# EAGLE schematic cnc-data-panel (EAGLE 7.3.0)
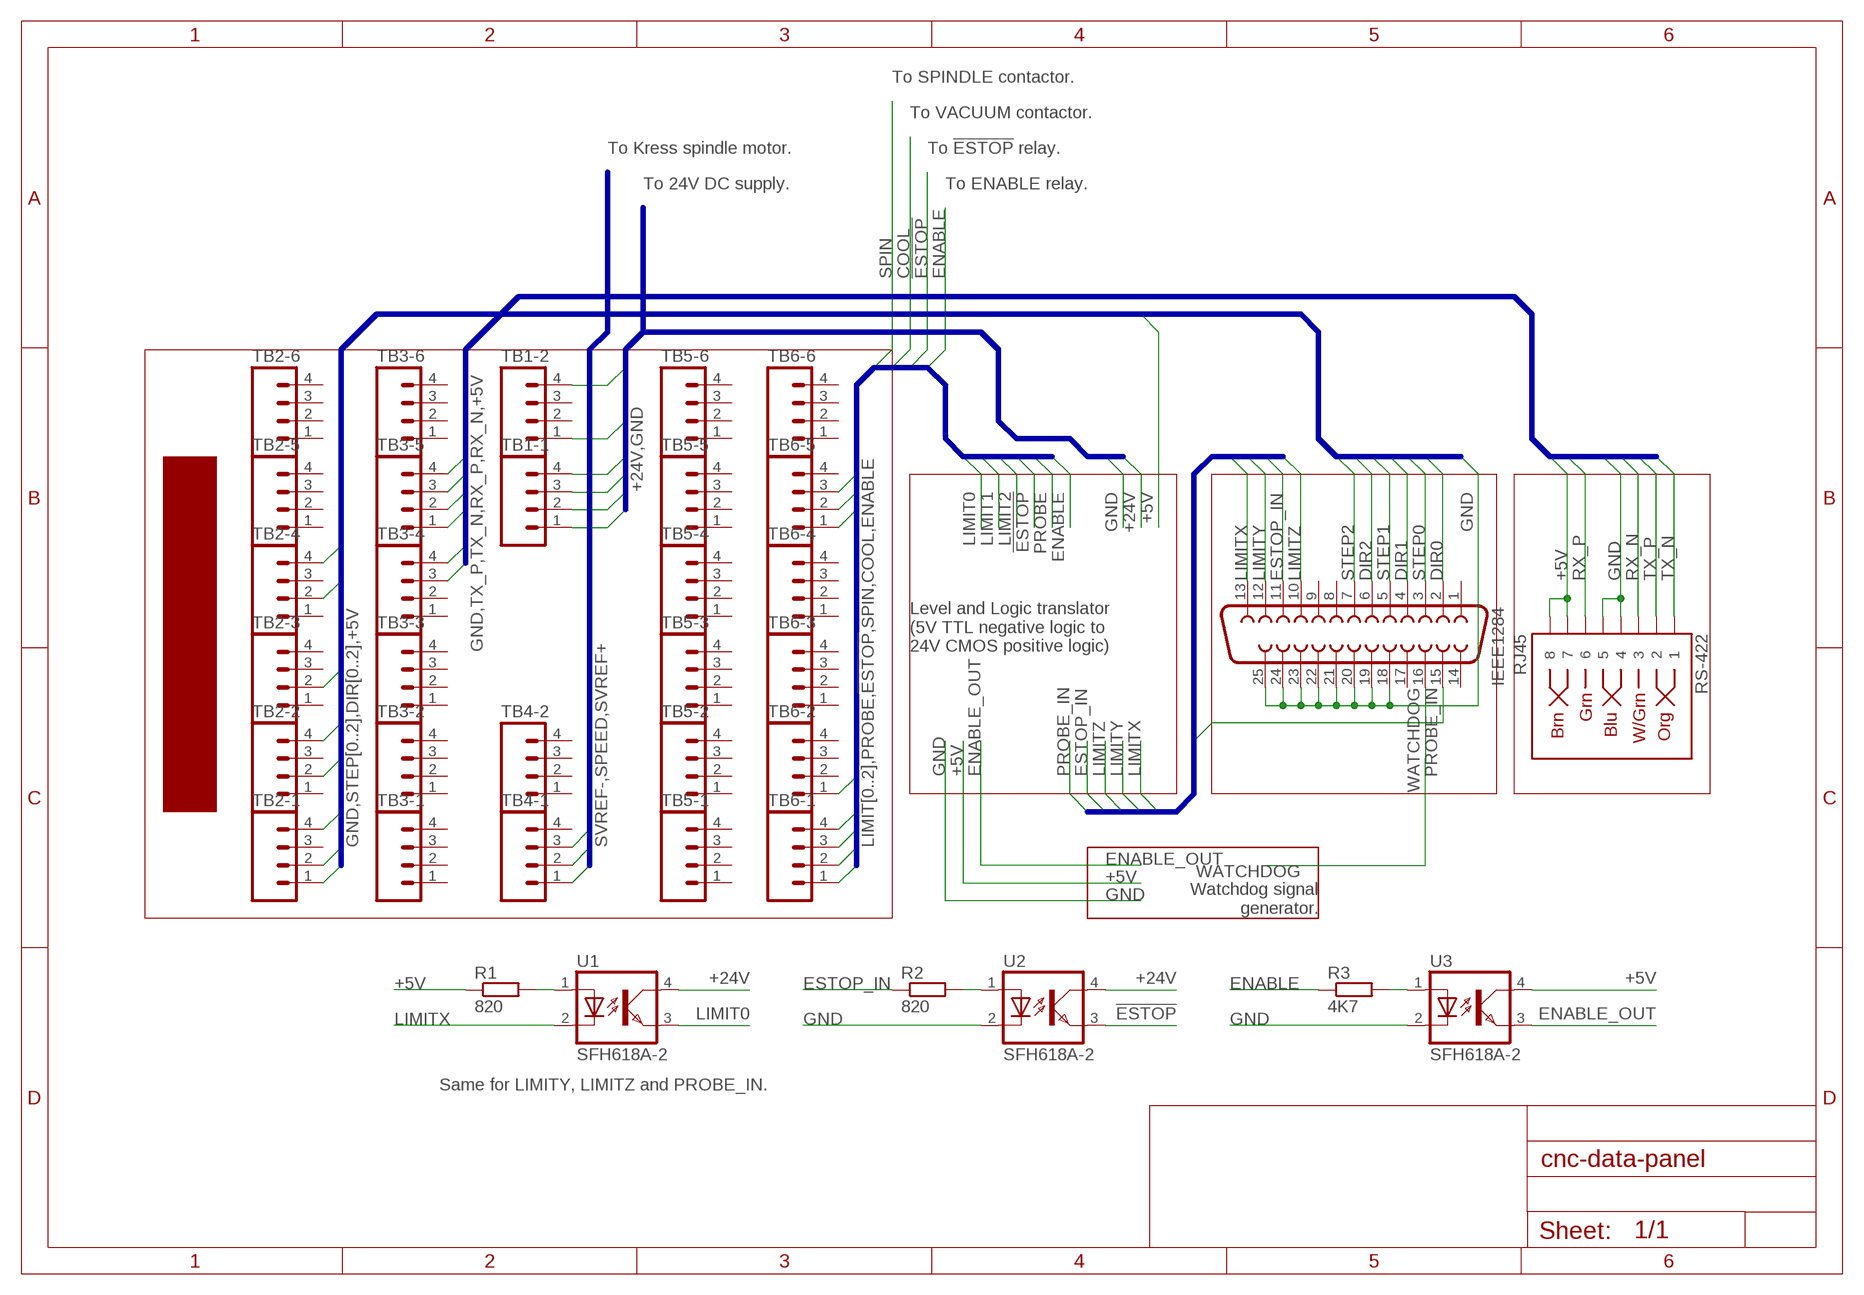
[diagram p0: schematic, sheet 1]

## Parts
IEEE1284  F25VP  [F25VP]
R1  820  R-EU_0204/2V  [0204V]
R2  820  R-EU_0204/2V  [0204V]
R3  4K7  R-EU_0204/2V  [0204V]
RS-422  RJ45  RJ45-8PTH  [RJ45-8]
TB1-1  M04SCREW  [SCREWTERMINAL-3.5MM-4]
TB1-2  M04SCREW  [SCREWTERMINAL-3.5MM-4]
TB2-1  M04SCREW  [SCREWTERMINAL-3.5MM-4]
TB2-2  M04SCREW  [SCREWTERMINAL-3.5MM-4]
TB2-3  M04SCREW  [SCREWTERMINAL-3.5MM-4]
TB2-4  M04SCREW  [SCREWTERMINAL-3.5MM-4]
TB2-5  M04SCREW  [SCREWTERMINAL-3.5MM-4]
TB2-6  M04SCREW  [SCREWTERMINAL-3.5MM-4]
TB3-1  M04SCREW  [SCREWTERMINAL-3.5MM-4]
TB3-2  M04SCREW  [SCREWTERMINAL-3.5MM-4]
TB3-3  M04SCREW  [SCREWTERMINAL-3.5MM-4]
TB3-4  M04SCREW  [SCREWTERMINAL-3.5MM-4]
TB3-5  M04SCREW  [SCREWTERMINAL-3.5MM-4]
TB3-6  M04SCREW  [SCREWTERMINAL-3.5MM-4]
TB4-1  M04SCREW  [SCREWTERMINAL-3.5MM-4]
TB4-2  M04SCREW  [SCREWTERMINAL-3.5MM-4]
TB5-1  M04SCREW  [SCREWTERMINAL-3.5MM-4]
TB5-2  M04SCREW  [SCREWTERMINAL-3.5MM-4]
TB5-3  M04SCREW  [SCREWTERMINAL-3.5MM-4]
TB5-4  M04SCREW  [SCREWTERMINAL-3.5MM-4]
TB5-5  M04SCREW  [SCREWTERMINAL-3.5MM-4]
TB5-6  M04SCREW  [SCREWTERMINAL-3.5MM-4]
TB6-1  M04SCREW  [SCREWTERMINAL-3.5MM-4]
TB6-2  M04SCREW  [SCREWTERMINAL-3.5MM-4]
TB6-3  M04SCREW  [SCREWTERMINAL-3.5MM-4]
TB6-4  M04SCREW  [SCREWTERMINAL-3.5MM-4]
TB6-5  M04SCREW  [SCREWTERMINAL-3.5MM-4]
TB6-6  M04SCREW  [SCREWTERMINAL-3.5MM-4]
U1  SFH618A-2  [DIP4]
U2  SFH618A-2  [DIP4]
U3  SFH618A-2  [DIP4]

## Nets
!ESTOP: TB6-2.1 U2.3(EMIT)
+5V: R1.1 RS-422.7 RS-422.8 TB2-2.2 TB3-5.4 U3.4(COL)
+24V: TB1-1.1 TB1-1.2 TB1-1.3 TB1-1.4 TB1-2.1 U1.4(COL) U2.4(COL)
COOL: TB6-5.2
DIR0: IEEE1284.2 TB2-1.4
DIR1: IEEE1284.4 TB2-3.2
DIR2: IEEE1284.6 TB2-4.4
ENABLE: R3.1 TB6-5.3
ENABLE_OUT: U3.3(EMIT)
ESTOP_IN: IEEE1284.11 R2.1
GND: IEEE1284.18 IEEE1284.19 IEEE1284.20 IEEE1284.21 IEEE1284.22 IEEE1284.23 IEEE1284.24 IEEE1284.25 RS-422.4 RS-422.5 TB1-2.4 TB2-1.1 TB3-4.3 U2.2(C) U3.2(C)
LIMIT0: TB6-1.1 U1.3(EMIT)
LIMIT1: TB6-1.2
LIMIT2: TB6-1.3
LIMITX: IEEE1284.13 U1.2(C)
LIMITY: IEEE1284.12
LIMITZ: IEEE1284.10
N$1: R1.2 U1.1(A)
N$2: R2.2 U2.1(A)
N$3: R3.2 U3.1(A)
PROBE: TB6-1.4
PROBE_IN: IEEE1284.15
RX_N: RS-422.3 TB3-5.1
RX_P: RS-422.6 TB3-4.4
SPEED: TB4-1.2
SPIN: TB6-5.1
STEP0: IEEE1284.3 TB2-1.2
STEP1: IEEE1284.5 TB2-2.4
STEP2: IEEE1284.7 TB2-4.2
SVREF+: TB4-1.3
SVREF-: TB4-1.1
TX_N: RS-422.1 TB3-5.3
TX_P: RS-422.2 TB3-5.2
WATCHDOG: IEEE1284.16
Unconnected: IEEE1284.1 IEEE1284.8 IEEE1284.9 IEEE1284.14 IEEE1284.17 TB1-2.2 TB1-2.3 TB2-1.3 TB2-2.1 TB2-2.3 TB2-3.1 TB2-3.3 TB2-3.4 TB2-4.1 TB2-4.3 TB2-5.1 TB2-5.2 TB2-5.3 TB2-5.4 TB2-6.1 TB2-6.2 TB2-6.3 TB2-6.4 TB3-1.1 TB3-1.2 TB3-1.3 TB3-1.4 TB3-2.1 TB3-2.2 TB3-2.3 TB3-2.4 TB3-3.1 TB3-3.2 TB3-3.3 TB3-3.4 TB3-4.1 TB3-4.2 TB3-6.1 TB3-6.2 TB3-6.3 TB3-6.4 TB4-1.4 TB4-2.1 TB4-2.2 TB4-2.3 TB4-2.4 TB5-1.1 TB5-1.2 TB5-1.3 TB5-1.4 TB5-2.1 TB5-2.2 TB5-2.3 TB5-2.4 TB5-3.1 TB5-3.2 TB5-3.3 TB5-3.4 TB5-4.1 TB5-4.2 TB5-4.3 TB5-4.4 TB5-5.1 TB5-5.2 TB5-5.3 TB5-5.4 TB5-6.1 TB5-6.2 TB5-6.3 TB5-6.4 TB6-2.2 TB6-2.3 TB6-2.4 TB6-3.1 TB6-3.2 TB6-3.3 TB6-3.4 TB6-4.1 TB6-4.2 TB6-4.3 TB6-4.4 TB6-5.4 TB6-6.1 TB6-6.2 TB6-6.3 TB6-6.4

## Buses
GND,STEP[0..2],DIR[0..2],+5V
GND,TX_P,TX_N,RX_P,RX_N,+5V
SVREF-,SPEED,SVREF+
+24V,GND
LIMIT[0..2],PROBE,!ESTOP,SPIN,COOL,ENABLE
LIMITX,LIMITY,LIMITZ,ESTOP_IN,PROBE_IN

## Notes on the sheet
- To SPINDLE contactor.
- To VACUUM contactor.
- To Kress spindle motor. | To !ESTOP! relay.
- To 24V DC supply. | To ENABLE relay.
- Level and Logic translator
  (5V TTL negative logic to
  24V CMOS positive logic)
- Watchdog signal
  generator.
- Same for LIMITY, LIMITZ and PROBE_IN.

## Library data of the parts
IEEE1284 = SparkFun-Connectors:F25: 25 Pin male connector. PCB edge mount for regular PCB thicknesses. This connector will connect directly to the back of a PC parallel port or through a normal DB25 extension cable (M/F). SKU: PRT-08287
R1-R3 = rcl:R-EU_: RESISTOR, European symbol
RS-422 = SparkFun-Connectors:RJ45-8: RJ45 Jack Simple RJ45, 8-pin connection - connector for common Cat5, Cat5e, and Cat6 Ethernet cables. Footprint not yet proven in production. Connector sku is PRT-00643; Breakout PCB sku is BOB-00716.; PROD_ID: CONN-08506
TB1-1 TB1-2 TB2-1-TB2-6 TB3-1-TB3-6 TB4-1 TB4-2 TB5-1-TB5-6 TB6-1-TB6-6 = SparkFun-Connectors:M04: Header 4 Standard 4-pin 0.1" header. Use with straight break away headers (SKU : PRT-00116), right angle break away headers (PRT-00553), swiss pins (PRT-00743), machine pins (PRT-00117), and female headers (PRT-00115). Molex polarized connector foot print use with SKU : PRT-08231 with associated crimp pins and housings. 1MM SMD Version SKU: PRT-10208; PROD_ID: Combine 2x8399
U1-U3 = optocoupler:SFH618?*: Optocoupler, Phototransistor Output, Low Input Current Source: Data sheet <http://www.vishay.com/docs/83673/sfh618.pdf>; MF: VISHAY/TELEFUNKEN; MPN: SFH618A-2; OC_FARNELL: 6424855; OC_NEWARK: 21H7744